# Altium schematic sheet dsPIC Click Analog v1.0.SchDoc
size B; CompanyName: Microchip Technology Inc.; Organization: Microchip Technology; Address1: 2355 West Chandler Blvd.; Address2: Chandler, AZ  85224; Address4: USA; SheetNumber: 2; SheetTotal: 2; SheetTitle: **; PageSetup: Record=PageOptions|CenterHorizontal=True|CenterVertical=True|PrintScale=0.71|XCorrection=1.00|YCorrection=1.00|PrintKind=0|BorderSize=5000000|LeftOffset=0|BottomOffset=0|Orientation=2|PaperLength=1000|PaperWidth=1000|Scale=100|PaperSource=7|PrintQuality=-3|MediaType=1|DitherType=10|PrintScaleMode=1|PaperKind=Letter|PaperIndex=1; Time: Time
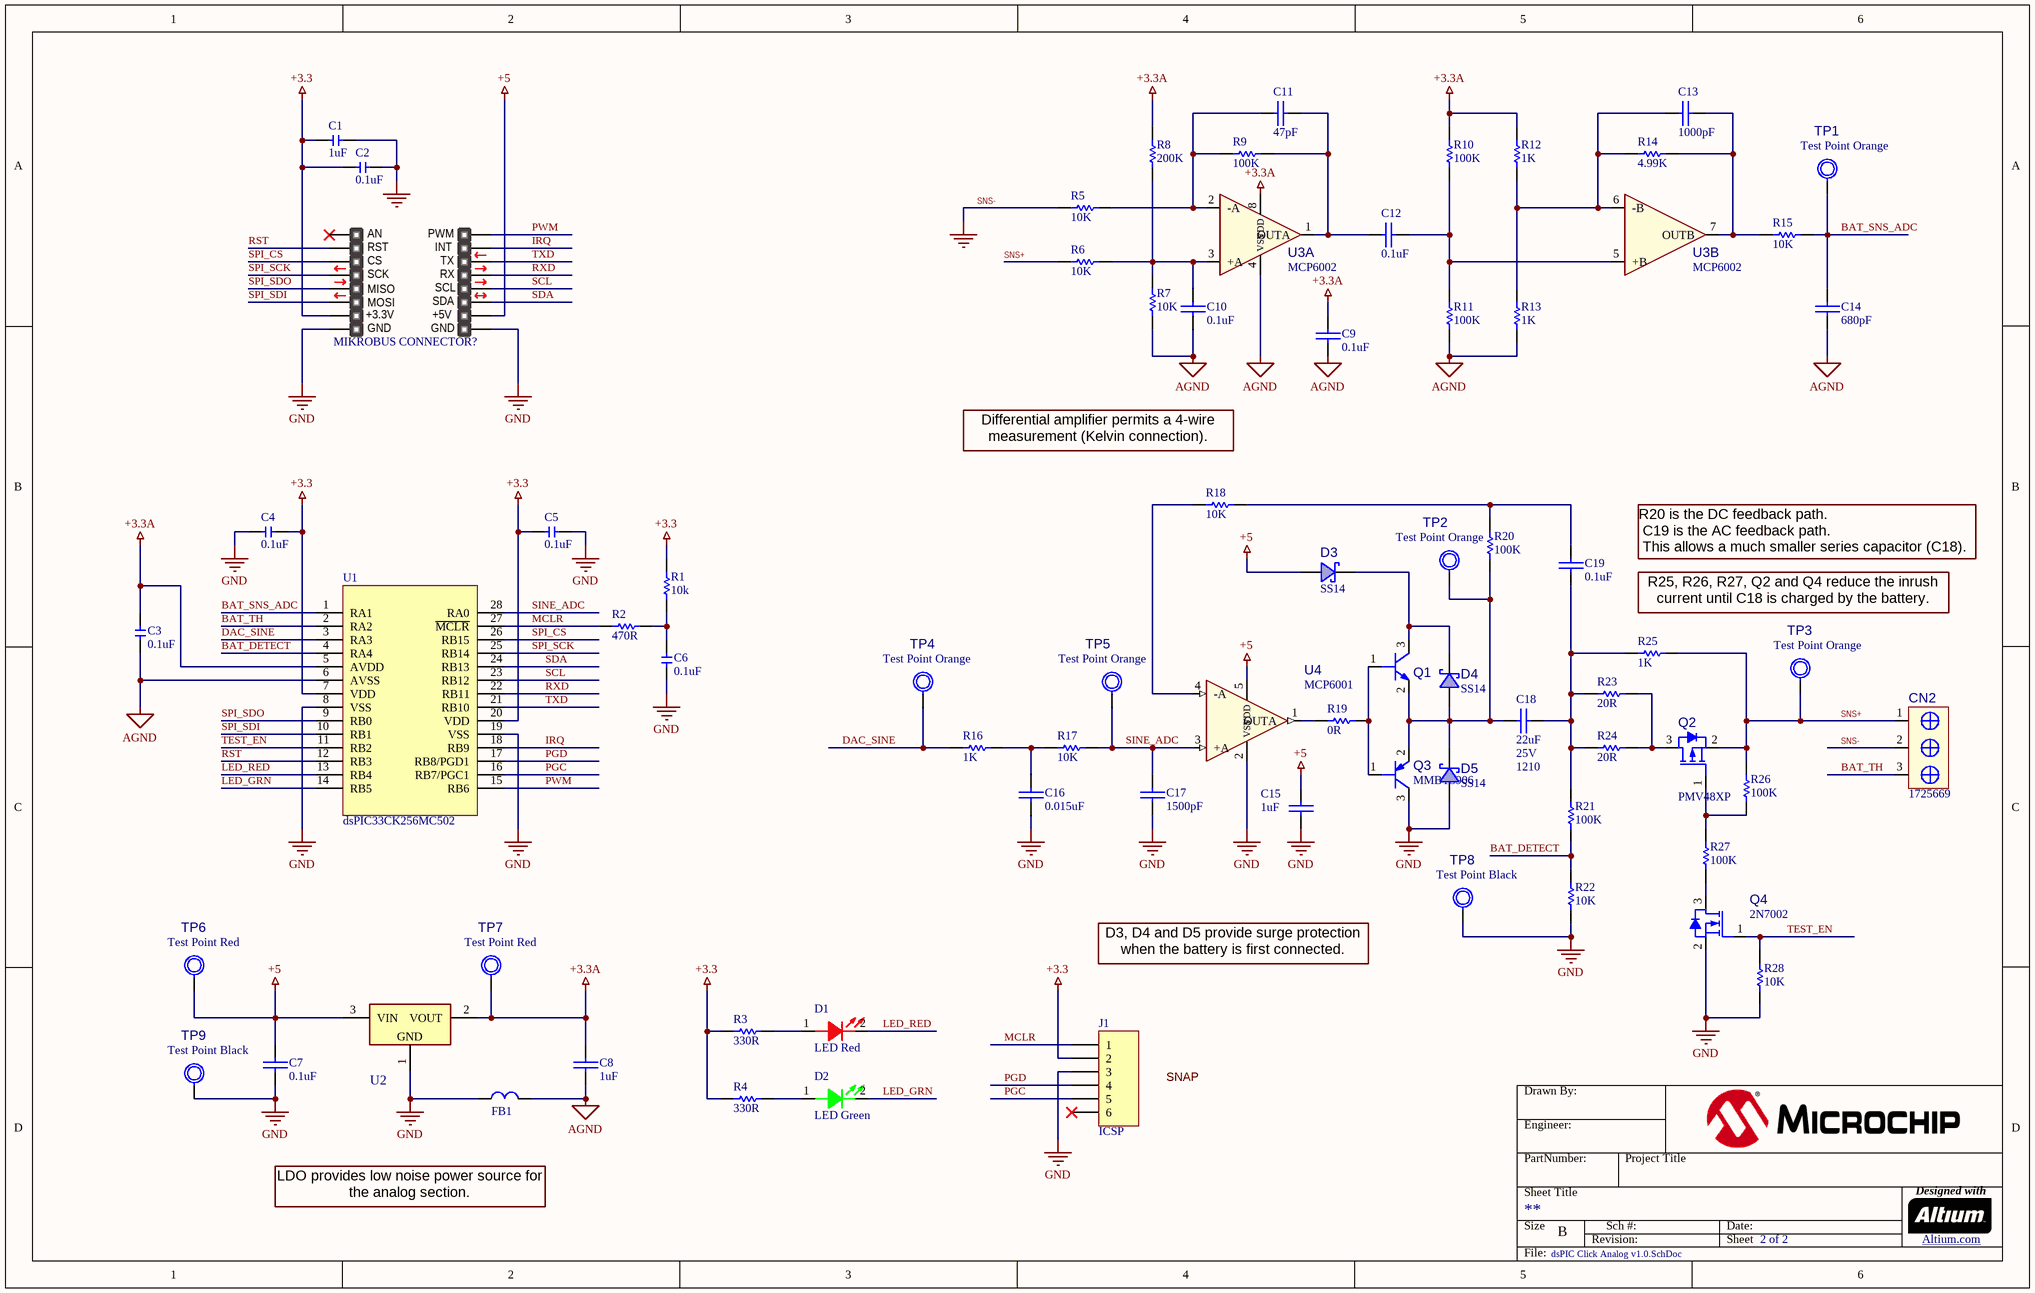
[diagram p0: dsPIC Click Analog v1.0.SchDoc]

## Parts
(Parts that share a designator on the sheet are numbered #1, #2 ... from top to bottom, then left to right.)
?#1  MikroBusLogo  [MB_Large]  (value not drawn)
?#2  (no value)  (graphical)
C1  1uF  [0603]
C2  0.1uF  [0603]
C3  0.1uF  [0603]
C4  0.1uF  [0603]
C5  0.1uF  [0603]
C6  0.1uF  [0603]
C7  0.1uF  [0603]
C8  1uF  [0603]
C9  0.1uF  [0603]
C10  0.1uF  [0603]
C11  47pF  [0603]
C12  0.1uF  [0603]
C13  1000pF  [0603]
C14  680pF  [0603]
C15  1uF  [0603]
C16  0.015uF  [0603]
C17  1500pF  [0603]
C18  22uF  [0603]
C19  0.1uF  [0603]
CN2  1725669  [1725669]
D1  LED Red  [LTST-C190]
D2  LED Green  [LTST-C190]
D3  SS14  [SMA-FL]
D4  SS14  [SMA-FL]
D5  SS14  [SMA-FL]
FB1  FB  [0603]  (value not drawn)
J1  ICSP  [HDR1X6]
MIKROBUS_CONNECTOR?  MIKROBUS DEVICE CONN.  [MIKRO_BUS_WS2812]  (value not drawn)
Q1  MMBT3904  [SOT-23]  (value not drawn)
Q2  PMV48XP  [SOT-23]
Q3  MMBT3906  [SOT-23]
Q4  2N7002  [SOT-23]
R1  10k  [0603]
R2  470R  [0603]
R3  330R  [0603]
R4  330R  [0603]
R5  10K  [0603]
R6  10K  [0603]
R7  10K  [0603]
R8  200K  [0603]
R9  100K  [0603]
R10  100K  [0603]
R11  100K  [0603]
R12  1K  [0603]
R13  1K  [0603]
R14  4.99K  [0603]
R15  10K  [0603]
R16  1K  [0603]
R17  10K  [0603]
R18  10K  [0603]
R19  0R  [0603]
R20  100K  [0603]
R21  100K  [0603]
R22  10K  [0603]
R23  20R  [0603]
R24  20R  [0603]
R25  1K  [0603]
R26  100K  [0603]
R27  100K  [0603]
R28  10K  [0603]
TP1  Test Point  [TP_KEYSTONE_5003]  (value not drawn)
TP2  Test Point  [TP_KEYSTONE_5003]  (value not drawn)
TP3  Test Point  [TP_KEYSTONE_5003]  (value not drawn)
TP4  Test Point  [TP_KEYSTONE_5003]  (value not drawn)
TP5  Test Point  [TP_KEYSTONE_5003]  (value not drawn)
TP6  Test Point Red  [TP_KEYSTONE_5003]
TP7  Test Point  [TP_KEYSTONE_5003]  (value not drawn)
TP8  Test Point  [TP_KEYSTONE_5003]  (value not drawn)
TP9  Test Point  [TP_KEYSTONE_5003]  (value not drawn)
U1  dsPIC33CK256MC502  [SSOP-28]
U2  MCP1754ST-3.3v  [SOT-23]  (value not drawn)
U3  MCP6002  [SOIC-8]  (parts A,B of 2)
U4  MCP6001  [TSOP-5]

## Nets
+3.3: C1.2 C2.1 C4.2 C5.1 J1.2 MIKROBUS_CONNECTOR?.7(3.3V) R1.2 R3.2 R4.2 U1.7(VDD) U1.20(VDD)
+3.3A: C3.2 C8.1 C9.1 R8.2 R10.2 R12.2 TP7.1 U1.5(AVDD) U2.2(VOUT) U3.8(VDD)
+5: C7.1 C15.1 D3.1(A) MIKROBUS_CONNECTOR?.10(5V) TP6.1 U2.3(VIN) U4.5(VDD)
AGND: C3.1 C8.2 C9.2 C10.2 C14.1 FB1.2 R7.1 R11.1 R13.1 U1.6(AVSS) U3.4(VSS)
SNS-: C1.1 C2.2 C4.1 C5.2 C6.2 C7.2 C15.2 C16.2 C17.2 CN2.2 D5.1(A) FB1.1 J1.3 MIKROBUS_CONNECTOR?.8(GND) MIKROBUS_CONNECTOR?.9(GND) Q3.3(C) Q4.2(S) R5.1 R22.1 R28.2 TP8.1 TP9.1 U1.8(VSS) U1.19(VSS) U2.1(GND) U4.2(VSS)  [also labelled GND]
BAT_DETECT: R21.1 R22.2 U1.4(RA4)
BAT_SNS_ADC: C14.2 R15.1 TP1.1 U1.1(RA1)
BAT_TH: CN2.3 U1.2(RA2)
DAC_SINE: R16.1 TP4.1 U1.3(RA3)
IRQ: MIKROBUS_CONNECTOR?.15(INT) U1.18(RB9)
LED_GRN: D2.2(K) U1.14(RB5)
LED_RED: D1.2(K) U1.13(RB4)
MCLR: J1.1 R2.1 U1.27(~{MCLR})
PGC: J1.5 U1.16(RB7/PGC1)
PGD: J1.4 U1.17(RB8/PGD1)
PWM: MIKROBUS_CONNECTOR?.16(PWM) U1.15(RB6)
RST: MIKROBUS_CONNECTOR?.2(RST) U1.12(RB3)
RXD: MIKROBUS_CONNECTOR?.13(TX) U1.22(RB11)
SCL: MIKROBUS_CONNECTOR?.12(SCL) U1.23(RB12)
SDA: MIKROBUS_CONNECTOR?.11(SDA) U1.24(RB13)
SINE_ADC: C17.1 R17.2 TP5.1 U1.28(RA0) U4.3(+A)
SNS+: CN2.1 Q2.2(S) R6.1 R25.1 R26.1 TP3.1
SPI_CS: MIKROBUS_CONNECTOR?.3(CS) U1.26(RB15)
SPI_SCK: MIKROBUS_CONNECTOR?.4(SCK) U1.25(RB14)
SPI_SDI: MIKROBUS_CONNECTOR?.6(MOSI) U1.10(RB1)
SPI_SDO: MIKROBUS_CONNECTOR?.5(MISO) U1.9(RB0)
TEST_EN: Q4.1(G) R28.1 U1.11(RB2)
TXD: MIKROBUS_CONNECTOR?.14(RX) U1.21(RB10)
NetC6_1: C6.1 R1.1 R2.2
NetC10_1: C10.1 R6.2 R7.2 R8.1 U3.3(+A)
NetC11_1: C11.1 R5.2 R9.2 U3.2(-A)
NetC11_2: C11.2 C12.1 R9.1 U3.1(OUTA)
NetC12_2: C12.2 R10.1 R11.2 U3.5(+B)
NetC13_1: C13.1 R12.1 R13.2 R14.2 U3.6(-B)
NetC13_2: C13.2 R14.1 R15.2 U3.7(OUTB)
NetC16_1: C16.1 R16.2 R17.1
NetC18_1: C18.1 D4.1(A) D5.2(K) Q1.2(E) Q3.2(E) R20.1 TP2.1
NetC18_2: C18.2 C19.1 R21.2 R23.2 R24.2 R25.2
NetC19_2: C19.2 R18.2 R20.2
NetD1_1: D1.1(A) R3.1
NetD2_1: D2.1(A) R4.1
NetD3_2: D3.2(K) D4.2(K) Q1.3(C)
NetQ1_1: Q1.1(B) Q3.1(B) R19.2
NetQ2_1: Q2.1(G) R26.2 R27.1
NetQ2_3: Q2.3(D) R23.1 R24.1
NetQ4_3: Q4.3(D) R27.2
NetR18_1: R18.1 U4.4(-A)
NetR19_1: R19.1 U4.1(OUTA)

Not connected (* = marked no-connect by the designer): J1 6*; MIKROBUS_CONNECTOR? 1(AN)*

## Notes on the sheet
- Differential amplifier permits a 4-wire measurement (Kelvin connection).
- R20 is the DC feedback path.
  C19 is the AC feedback path.
  This allows a much smaller series capacitor (C18).
- (near R25) R25, R26, R27, Q2 and Q4 reduce the inrush current until C18 is charged by the battery.
- D3, D4 and D5 provide surge protection when the battery is first connected.
- SNAP
- LDO provides low noise power source for the analog section.
- Drawn By:
- Engineer:
- PartNumber:
- Project Title
- Sheet Title
- Size
- B
- Revision:
- Sch #:
- Date:
- Sheet
- Designed with
- Altium.com <http://go.altium.com/MicrochipLandingPage_Evaluation.html>
- File:
- (in symbol CAP) 25V; 1210
- (in symbol MIKROBUS DEVICE CONN.) +3.3V; +5V
- (in symbol Test Point) Test Point Red; Test Point Black; Test Point Orange

## Library data of the parts
?#1 = MikroBusLogo: Logo; Published: 8-Jun-2000; LatestRevisionDate: 17-Jul-2002; LatestRevisionNote: Re-released for DXP Platform.; PackageReference: AXIAL-0.3; Publisher: Altium Limited; PackageDescription: Axial Device, Thru-Hole; 2 Leads; 0.3 in Pin Spacing
?#2 = Title Block B
C1-C6 = Capacitor NP: Capacitor; Type: Ceramic; Revision: 0; ComponentLink1Description: Datasheet; Operating Temperature: -55C to +125C; Category: Capacitor; Quantity Override: 1
C7-C19 = CAP: Capacitor
CN2 = 1725669: Terminal Block, 3-Position; Manufacturer 1: Phoenix Contact; Manufacturer Part Number 1: 1725672; MCHP-ID: CON0005; Symbol: Header 1x4; Description_: CON TERMINAL 2.54mm 1x4 Female 20-30AWG 6A TH R/A; Dev Tools Status: Production; Owner: Sorin Stanoaia; Voltage: 63V; Current: 6A; Populated: YES; Value: TERMINAL 1x4; Revision: 0; Status: MCL Design; ComponentLink1URL: https://chn-vm-apps.microchip.com/mchprepo/parts/Datasheets/1725672.pdf; ComponentLink1Description: SVN Datasheet; ComponentLink2URL: C:\ALTIUM_WORK\00001_MCHP-CDB\Datasheets\1725672.pdf; ComponentLink2Description: Local Datasheet; ComponentLink3URL: C:\ALTIUM_WORK\00001_MCHP-CDB\Library\LibraryRefs\Header 1x4.SchLib; ComponentLink3Description: Open Symbol; ComponentLink4URL: C:\ALTIUM_WORK\00001_MCHP-CDB\Library\Footprints\CON_TERMINAL_2.54_1x4_TH_RA_PHO_1725672.PcbLib; ComponentLink4Description: Open Footprint; ComponentLink5Description: Open Footprint 2; ComponentLink6Description: Open Footprint 3; ComponentLink7Description: Open Footprint 4; Type: Terminal Block; Category: Connector; Manufacturer 2: Degson Electronics Co., Ltd.; Manufacturer Part Number 2: DG308-2.54-04P-14-00A(H); Supplier 1: Digi-Key; Supplier Part Number 1: 277-1275-ND; Supplier 2: Raynen; Supplier Part Number 2: CONN00186B01M; Quantity Override: 1
D1 = LED_RED: Red LED; Manufacturer 1: Lumex; Manufacturer Part Number 1: SML-LXT0805IW-TR; MCHP-ID: LED1020; Description_: DIO LED RED 2V 30mA 0805; Type: LED Single; Forward Current: 30mA; Power: 50mW; Reverse Current: 100uA; Reverse Voltage: 5V; Owner: Stephen Humberd; Populated: YES; Revision: A; Status: Design; Package: 0805; ComponentLink1URL: https://chn-vm-apps.microchip.com/mchprepo/parts/Datasheets/SML-LXT0805IW-TR.pdf; ComponentLink1Description: Datasheet; Operating Temperature: -25C to +80C; Category: Diode; Supplier 1: Digi-Key; Supplier Part Number 1: 67-1552-1-ND; Quantity Override: 1; Value: RED
D2 = LED_GRN: Green LED; Manufacturer 1: Lumex; Manufacturer Part Number 1: SML-LXT0805IW-TR; MCHP-ID: LED1020; Description_: DIO LED RED 2V 30mA 0805; Type: LED Single; Forward Current: 30mA; Power: 50mW; Reverse Current: 100uA; Reverse Voltage: 5V; Owner: Stephen Humberd; Populated: YES; Value: GRN; Revision: A; Status: Design; Package: 0805; ComponentLink1URL: https://chn-vm-apps.microchip.com/mchprepo/parts/Datasheets/SML-LXT0805IW-TR.pdf; ComponentLink1Description: Datasheet; Operating Temperature: -25C to +80C; Category: Diode; Supplier 1: Digi-Key; Supplier Part Number 1: 67-1552-1-ND; Quantity Override: 1
D3-D5 = SS14: Diode, Schottky; Manufacturer 1: Fairchild; MCHP-ID: DIODE0128; Symbol: Diode Schottky; Description_: DIO SCTKY SS14 500mV 1A 40V DO-214AC_SMA; Dev Tools Status: Production; Type: Schottky Single; Forward Current: 1A; Power: 1.1W; Reverse Current: 200uA; Reverse Voltage: 40V; Populated: YES; Revision: 1; Status: MCL Design; Package: DO-214AC_SMA; ComponentLink1URL: https://chn-vm-apps.microchip.com/mchprepo/parts/Datasheets/SS12.pdf; ComponentLink1Description: SVN Datasheet; ComponentLink2URL: C:\ALTIUM_WORK\00001_MCHP-CDB\Datasheets\SS12.pdf; ComponentLink2Description: Local Datasheet; ComponentLink3URL: C:\ALTIUM_WORK\00001_MCHP-CDB\Library\LibraryRefs\Diode Schottky.SchLib; ComponentLink3Description: Open Symbol; ComponentLink4URL: C:\ALTIUM_WORK\00001_MCHP-CDB\Library\Footprints\DO-214AC_SMA.PcbLib; ComponentLink4Description: Open Footprint; ComponentLink5Description: Open Footprint 2; ComponentLink6Description: Open Footprint 3; ComponentLink7Description: Open Footprint 4; Operating Temperature: -65C to +125C; Category: Diode; Manufacturer Part Number 1: SS14; Supplier 1: Digi-Key; Supplier Part Number 1: SS14CT-ND; Quantity Override: 1
FB1 = FB: Ferrite Bead; Manufacturer 1: TDK; Manufacturer Part Number 1: FLF3215T-4R7M; MCHP-ID: IND0071; Description_: INDUCTOR 4.7uH 1A 20% SMD 1210; Type: Inductor; DCR: 0.09R; Saturation Current: 1A; Test Frequency: 1MHz; Populated: Yes; Revision: 1; Status: Production; ComponentLink1URL: https://chn-vm-apps.microchip.com/mchprepo/parts/Datasheets/e531_flf3215.pdf; ComponentLink1Description: Datasheet; Operating Temperature: -40C to +125C; Package: 1210; Category: Inductor; Supplier 1: Digi-Key; Supplier Part Number 1: 445-4846-2-ND; Quantity Override: 1
J1 = Header 6: Header, 6-Pin; LatestRevisionDate: 17-Jul-2002; LatestRevisionNote: Re-released for DXP Platform.; Publisher: Altium Limited
MIKROBUS_CONNECTOR? = MIKROBUS DEVICE CONN.: mikroBUS Target Header
Q1 = MMBBT3904: Transistor, NPN; Manufacturer 1: Diodes Incorporated; Manufacturer Part Number 1: MMBT3904-7; MCHP-ID: TRA0006; Symbol: Transistor NPN BEC; Description_: TRANS BJT NPN MMBT3904 40V 200mA 310mW SOT-23-3; Dev Tools Status: Production; Type: BJT; Current: 200mA; Power: 310mW; Voltage: 40V; Populated: Yes; Revision: 3; Status: MCL Design; Package: SOT-23-3; ComponentLink1URL: https://chn-vm-apps.microchip.com/mchprepo/parts/Datasheets/ds30036.pdf; ComponentLink1Description: SVN Datasheet; ComponentLink2URL: C:\ALTIUM_WORK\00001_MCHP-CDB\Datasheets\ds30036.pdf; ComponentLink2Description: Local Datasheet; ComponentLink3URL: C:\ALTIUM_WORK\00001_MCHP-CDB\Library\LibraryRefs\Transistor NPN BEC.SchLib; ComponentLink3Description: Open Symbol; ComponentLink4URL: C:\ALTIUM_WORK\00001_MCHP-CDB\Library\Footprints\SOT-23-3.PcbLib; ComponentLink4Description: Open Footprint; ComponentLink5Description: Open Footprint 2; ComponentLink6Description: Open Footprint 3; ComponentLink7Description: Open Footprint 4; Operating Temperature: -55C to +150C; Category: Transistor; Manufacturer 2: Diodes Incorporated; Manufacturer Part Number 2: MMBT3904-7-F; Manufacturer 3: Fairchild; Manufacturer Part Number 3: MMBT3904; Manufacturer 4: Micro Commercial Components Corporation; Manufacturer Part Number 4: MMBT3904-TP; Manufacturer 5: NXP Semiconductors; Manufacturer Part Number 5: PMBT3904,215; Manufacturer 6: ON Semiconductor; Manufacturer Part Number 6: MMBT3904LT1G; Manufacturer 7: ON Semiconductor; Manufacturer Part Number 7: MMBT3904LT3G; Manufacturer 8: ON Semiconductor; Manufacturer Part Number 8: MMBT3904LT3; Manufacturer 9: STMicroelectronics; Manufacturer Part Number 9: MMBT3904; Supplier 1: Digi-Key; Supplier Part Number 1: MMBT3904TPMSCT-ND; Supplier 2: Digi-Key; Supplier Part Number 2: MMBT3904-FDITR-ND; Supplier 3: Digi-Key; Supplier Part Number 3: MMBT3904-FDICT-ND; Supplier 4: Digi-Key; Supplier Part Number 4: MMBT3904FSTR-ND; Supplier 5: Digi-Key; Supplier Part Number 5: MMBT3904TPMSCT-ND; Supplier 6: Digi-Key; Supplier Part Number 6: 568-1741-1-ND; Supplier 7: Digi-Key; Supplier Part Number 7: MMBT3904LT1GOSCT-ND; Supplier 8: Digi-Key; Supplier Part Number 8: MMBT3904LT3GOSTR-ND; Supplier 9: Digi-Key; Supplier Part Number 9: MMBT3904LT3OSCT-ND; Supplier 10: Digi-Key; Supplier Part Number 10: 497-2478-2-ND; Quantity Override: 1
Q2 = PMV48XP: MOSFET, P-Channel; Manufacturer 1: NXP Semiconductors; Manufacturer Part Number 1: PMV48XP,215; MCHP-ID: TRA1141; Symbol: Transistor MOS-P GSD; Description_: TRANS FET P-CH PMV48XP,215 20V 3.5A 510mW SOT-23-3; Dev Tools Status: Design; Type: FET; Current: 3.5A; Drain to Source Voltage: 20V; Gate to Source Voltage: 12V; Power: 510mW; Owner: Gabor Bihari; Populated: YES; Revision: A; Status: MCL Design; Package: SOT-23-3; ComponentLink1URL: https://chn-vm-apps.microchip.com/mchprepo/parts/Datasheets/PMV48XP.pdf; ComponentLink1Description: SVN Datasheet; ComponentLink2URL: C:\ALTIUM_WORK\00001_MCHP-CDB\Datasheets\PMV48XP.pdf; ComponentLink2Description: Local Datasheet; ComponentLink3URL: C:\ALTIUM_WORK\00001_MCHP-CDB\Library\LibraryRefs\Transistor MOS-P GSD.SchLib; ComponentLink3Description: Open Symbol; ComponentLink4URL: C:\ALTIUM_WORK\00001_MCHP-CDB\Library\Footprints\SOT-23-3.PcbLib; ComponentLink4Description: Open Footprint; ComponentLink5Description: Open Footprint 2; ComponentLink6Description: Open Footprint 3; ComponentLink7Description: Open Footprint 4; Operating Temperature: -55°C to 150°C; Category: Transistor; Supplier 1: Digi-Key; Supplier Part Number 1: 568-7579-1-ND; Quantity Override: 1
Q3 = MMBT3906: Transistor, PNP; Manufacturer 1: NXP Semiconductors; Manufacturer Part Number 1: PMBT3906,215; MCHP-ID: TRA0015; Symbol: Transistor PNP BEC; Description_: TRANS BJT PNP MMBT3906 -40V -200mA 300mW SOT-23-3; Dev Tools Status: Production; Type: BJT; Current: -200mA; Power: 300mW; Voltage: -40V; Populated: YES; Revision: 2; Status: MCL Design; Package: SOT-23-3; ComponentLink1URL: https://chn-vm-apps.microchip.com/mchprepo/parts/Datasheets/ds30059.pdf; ComponentLink1Description: SVN Datasheet; ComponentLink2URL: C:\ALTIUM_WORK\00001_MCHP-CDB\Datasheets\ds30059.pdf; ComponentLink2Description: Local Datasheet; ComponentLink3URL: C:\ALTIUM_WORK\00001_MCHP-CDB\Library\LibraryRefs\Transistor PNP BEC.SchLib; ComponentLink3Description: Open Symbol; ComponentLink4URL: C:\ALTIUM_WORK\00001_MCHP-CDB\Library\Footprints\SOT-23-3.PcbLib; ComponentLink4Description: Open Footprint; ComponentLink5Description: Open Footprint 2; ComponentLink6Description: Open Footprint 3; ComponentLink7Description: Open Footprint 4; Operating Temperature: -55C to +150C; Category: Transistor; Manufacturer 2: Fairchild; Manufacturer Part Number 2: MMBT3906; Manufacturer 3: Micro Commercial Components Corporation; Manufacturer Part Number 3: MMBT3906-TP; Manufacturer 4: Central Semiconductor; Manufacturer Part Number 4: CMPT3906-PST-LEADFREE; Manufacturer 5: Diodes Incorporated; Manufacturer Part Number 5: MMBT3906-7; Manufacturer 6: Diodes Incorporated; Manufacturer Part Number 6: MMBT3906-7-F; Manufacturer 7: ON Semiconductor; Manufacturer Part Number 7: MMBT3906LT1G; Manufacturer 8: Fairchild; Manufacturer Part Number 8: MMBT3906K; Supplier 1: Digi-Key; Supplier Part Number 1: 568-1742-1-ND; Supplier 2: Digi-Key; Supplier Part Number 2: MMBT3906FSTR-ND; Supplier 3: Digi-Key; Supplier Part Number 3: MMBT3906-TPCT-ND; Supplier 4: Central Semiconductor; Supplier Part Number 4: CMPT3906-PST-LEADFREE; Supplier 5: Digi-Key; Supplier Part Number 5: MMBT3906DITR-ND; Supplier 6: Digi-Key; Supplier Part Number 6: MMBT3906-FDICT-ND; Supplier 7: Diodes Incorporated; Supplier Part Number 7: MMBT3906-7-F; Supplier 8: Digi-Key; Supplier Part Number 8: MMBT3906LT1GOSTR-ND; Supplier 9: Fairchild; Supplier Part Number 9: MMBT3906K; Quantity Override: 1
Q4 = 2N7002: MOSFET; Manufacturer 1: Diodes Inc; Manufacturer Part Number 1: 2N7002-7-F; MCHP-ID: TRA1102; Symbol: Transistor MOS-N GSD; Description_: TRANS FET N-CH 2N7002-7-F 60V 170mA 370mW SOT-23-3; Dev Tools Status: Production; Type: FET; Current: 170mA; Drain to Source Voltage: 60V; Gate to Source Voltage: 20V; Power: 370mW; Owner: Adrian M (M91404); Populated: YES; Revision: 0; Status: MCL Design; Package: SOT-23-3; ComponentLink1URL: https://chn-vm-apps.microchip.com/mchprepo/parts/Datasheets/ds11303.pdf; ComponentLink1Description: SVN Datasheet; ComponentLink2URL: C:\ALTIUM_WORK\00001_MCHP-CDB\Datasheets\ds11303.pdf; ComponentLink2Description: Local Datasheet; ComponentLink3URL: C:\ALTIUM_WORK\00001_MCHP-CDB\Library\LibraryRefs\Transistor MOS-N GSD.SchLib; ComponentLink3Description: Open Symbol; ComponentLink4URL: C:\ALTIUM_WORK\00001_MCHP-CDB\Library\Footprints\SOT-23-3.PcbLib; ComponentLink4Description: Open Footprint; ComponentLink5Description: Open Footprint 2; ComponentLink6Description: Open Footprint 3; ComponentLink7Description: Open Footprint 4; Operating Temperature: -55C to +150C; Category: Transistor; Supplier 1: Digi-Key; Supplier Part Number 1: 2N7002-FDICT-ND; Quantity Override: 1
R1-R28 = Res1: Resistor; Published: 8-Jun-2000; LatestRevisionDate: 17-Jul-2002; LatestRevisionNote: Re-released for DXP Platform.; PackageReference: AXIAL-0.3; Publisher: Altium Limited; PackageDescription: Axial Device, Thru-Hole; 2 Leads; 0.3 in Pin Spacing
TP1-TP5 TP7-TP9 = Test Point: Test Point, 5003; Revision: 0
TP6 = Test Point: Test Point, 5003; Manufacturer 1: Keystone; Manufacturer Part Number 1: 5001; MCHP-ID: MISC0026; Description_: MISC, TEST POINT MULTI PURPOSE MINI BLACK; Dev Tools Status: Production; Owner: Stephen Humberd; Populated: YES; Revision: 0; Symbol: Test Point; Status: MCL Design; ComponentLink1URL: https://chn-vm-apps.microchip.com/mchprepo/parts/Datasheets/5000-5004.PDF; ComponentLink1Description: SVN Datasheet; ComponentLink2URL: C:\ALTIUM_WORK\00001_MCHP-CDB\Datasheets\5000-5004.PDF; ComponentLink2Description: Local Datasheet; ComponentLink3URL: C:\ALTIUM_WORK\00001_MCHP-CDB\Library\LibraryRefs\Test Point.SchLib; ComponentLink3Description: Open Symbol; ComponentLink4URL: C:\ALTIUM_WORK\00001_MCHP-CDB\Library\Footprints\CON_TP_TH_V_BLK_KEC_5001.PcbLib; ComponentLink4Description: Open Footprint; ComponentLink5Description: Open Footprint 2; ComponentLink6Description: Open Footprint 3; ComponentLink7Description: Open Footprint 4; Type: Test Point; Category: Connector; Supplier 1: Digi-Key; Supplier Part Number 1: 36-5001-ND; Quantity Override: 1
U1 = dsPIC33CK256MC502: 16-bit MCU
U2 = MCP1754S: LDO; Manufacturer 1: Microchip Technology; Manufacturer Part Number 1: MCP1754ST-3302E/CB; MCHP-ID: MIC7325; Description_: MCHP ANALOG LDO 3.3V MCP1754ST-3302E/CB SOT-23A-3; Symbol: MCP1754S SOT-23A-3; MAPS Description: 16V, High PSRR, 150mA LDO, Vout=3.3V; Dev Tools Status: Production; Owner: Iulian Margarit; MPC: V0AB2YM7XB00; PackingMedia: T/R; LeadCount: 3; TempRange: -40C to +125C; tblDeviceFamilyID: 3163; RailIn: False; Populated: YES; Type: LDO; Status: MCL Design; Revision: 1; Category: MCHP-Analog; ComponentLink1URL: http://www.microchip.com/wwwproducts/MCP1754S; ComponentLink1Description: SVN Datasheet; ComponentLink2Description: Local Datasheet; ComponentLink3URL: C:\ALTIUM_WORK\00001_MCHP-CDB\Library\LibraryRefs\MCP1754S SOT-23A-3.SchLib; ComponentLink3Description: Open Symbol; ComponentLink4URL: C:\ALTIUM_WORK\00001_MCHP-CDB\Library\Footprints\SOT-23A-3.PcbLib; ComponentLink4Description: Open Footprint; ComponentLink5Description: Open Footprint 2; ComponentLink6Description: Open Footprint 3; ComponentLink7Description: Open Footprint 4; Supplier 1: Digi-Key; Supplier Part Number 1: MCP1754ST-3302E/CBCT-ND; IntroductionDate: 2011-08-16; PackageType: SOT-23A; Brown_Out: False; Interconnect: False; Low_Batt: False; Power_Good: False; LED_Driver: False; Inductive_Boost: False; Charge_Pump: False; RailOut: False; InputChEnable: False; ProgWkUpFilter: False; WkUpPtnEnable: False; LFTalkFeture: False; EncryptAlg: False; Chamber_Test: False; Rev_Batt_Prot: False; Sens_Timer: False; Low_Bat: False; Alarm_Mem: False; Quantity Override: 1
U3 = MCP6002: OPAMP, Dual; Manufacturer 1: Microchip; Manufacturer Part Number 1: MCP6002T-I/SN; MCHP-ID: MIC0395; Description_: MCHP ANALOG OPAMP 2-Ch 1MHz MCP6002T-I/SN SOIC-8; Symbol: MCP6XX2_7 SOIC-8_MSOP-8_PDIP-8; MAPS Description: Dual 1.8V, 1MHz OP, I temp; Dev Tools Status: Production; MPC: ABBZ1TC2XA00; PackingMedia: T/R; LeadCount: 8; PackageWidth: 3.90mm(.150in); TempRange: -40C to +85C; tblDeviceFamilyID: 263; VDDmax: 5.5; VDDmin: 1.8; IqMax: 170; VosMax: 4500; RailIn: True; Brown_Out: False; Amplifiers: 2; GBWP_KHz: 1000; StableGainMin: 1; Populated: Yes; Type: OpAmp; Status: MCL Design; Revision: 1; Category: MCHP-Analog; ComponentLink1URL: http://www.microchip.com/wwwproducts/MCP6002; ComponentLink1Description: SVN Datasheet; ComponentLink2Description: Local Datasheet; ComponentLink3URL: C:\ALTIUM_WORK\00001_MCHP-CDB\Library\LibraryRefs\MCP6XX2_7 SOIC-8_MSOP-8_PDIP-8.SchLib; ComponentLink3Description: Open Symbol; ComponentLink4URL: C:\ALTIUM_WORK\00001_MCHP-CDB\Library\Footprints\SOIC-8.PcbLib; ComponentLink4Description: Open Footprint; ComponentLink5Description: Open Footprint 2; ComponentLink6Description: Open Footprint 3; ComponentLink7Description: Open Footprint 4; Manufacturer 2: Microchip; Manufacturer Part Number 2: MCP6002-I/SN; Supplier 1: Microchip; Supplier Part Number 1: MCP6002T-I/SN; Supplier 2: Microchip; Supplier Part Number 2: MCP6002-I/SN; IntroductionDate: 2012-06-28; PackageType: SOIC; Interconnect: False; Low_Batt: False; Power_Good: False; LED_Driver: False; Inductive_Boost: False; Charge_Pump: False; RailOut: True; InputChEnable: False; ProgWkUpFilter: False; WkUpPtnEnable: False; LFTalkFeture: False; EncryptAlg: False; Chamber_Test: False; Rev_Batt_Prot: False; Sens_Timer: False; Low_Bat: False; Alarm_Mem: False; Quantity Override: 1
U4 = MCP6001: OPAMP, Single; Manufacturer 1: Microchip; Manufacturer Part Number 1: MCP6001T-E/OT; MCHP-ID: MIC1055; Description_: MCHP ANALOG OPAMP 1-Ch 1MHz MCP6001T-E/OT SOT-23-5; Symbol: MCP6XX1_6 SOT-23-5_SC-70-5; MAPS Description: Single 1.8V, 1MHz OP; Dev Tools Status: Production; Owner: Ryan Hermens; MPC: ABBY1YC7XA00; PackingMedia: T/R; LeadCount: 5; TempRange: -40C to +125C; tblDeviceFamilyID: 262; VDDmax: 5.5; VDDmin: 1.8; IqMax: 170; VosMax: 4500; RailIn: True; Brown_Out: False; Amplifiers: 1; GBWP_KHz: 1000; Populated: Yes; Type: OpAmp; Status: MCL Design; Revision: 1; Category: MCHP-Analog; ComponentLink1URL: http://www.microchip.com/wwwproducts/MCP6001; ComponentLink1Description: SVN Datasheet; ComponentLink2Description: Local Datasheet; ComponentLink3URL: C:\ALTIUM_WORK\00001_MCHP-CDB\Library\LibraryRefs\MCP6XX1_6 SOT-23-5_SC-70-5.SchLib; ComponentLink3Description: Open Symbol; ComponentLink4URL: C:\ALTIUM_WORK\00001_MCHP-CDB\Library\Footprints\SOT-23-5.PcbLib; ComponentLink4Description: Open Footprint; ComponentLink5Description: Open Footprint 2; ComponentLink6Description: Open Footprint 3; ComponentLink7Description: Open Footprint 4; Supplier 1: Microchip; Supplier Part Number 1: MCP6001T-E/OT; IntroductionDate: 2003-11-06; PackageType: SOT-23; Comments: -; Interconnect: False; Low_Batt: False; Power_Good: False; LED_Driver: False; Inductive_Boost: False; Charge_Pump: False; StableGainMin: 1; RailOut: True; InputChEnable: False; ProgWkUpFilter: False; WkUpPtnEnable: False; LFTalkFeture: False; EncryptAlg: False; Chamber_Test: False; Rev_Batt_Prot: False; Sens_Timer: False; Low_Bat: False; Alarm_Mem: False; Quantity Override: 1